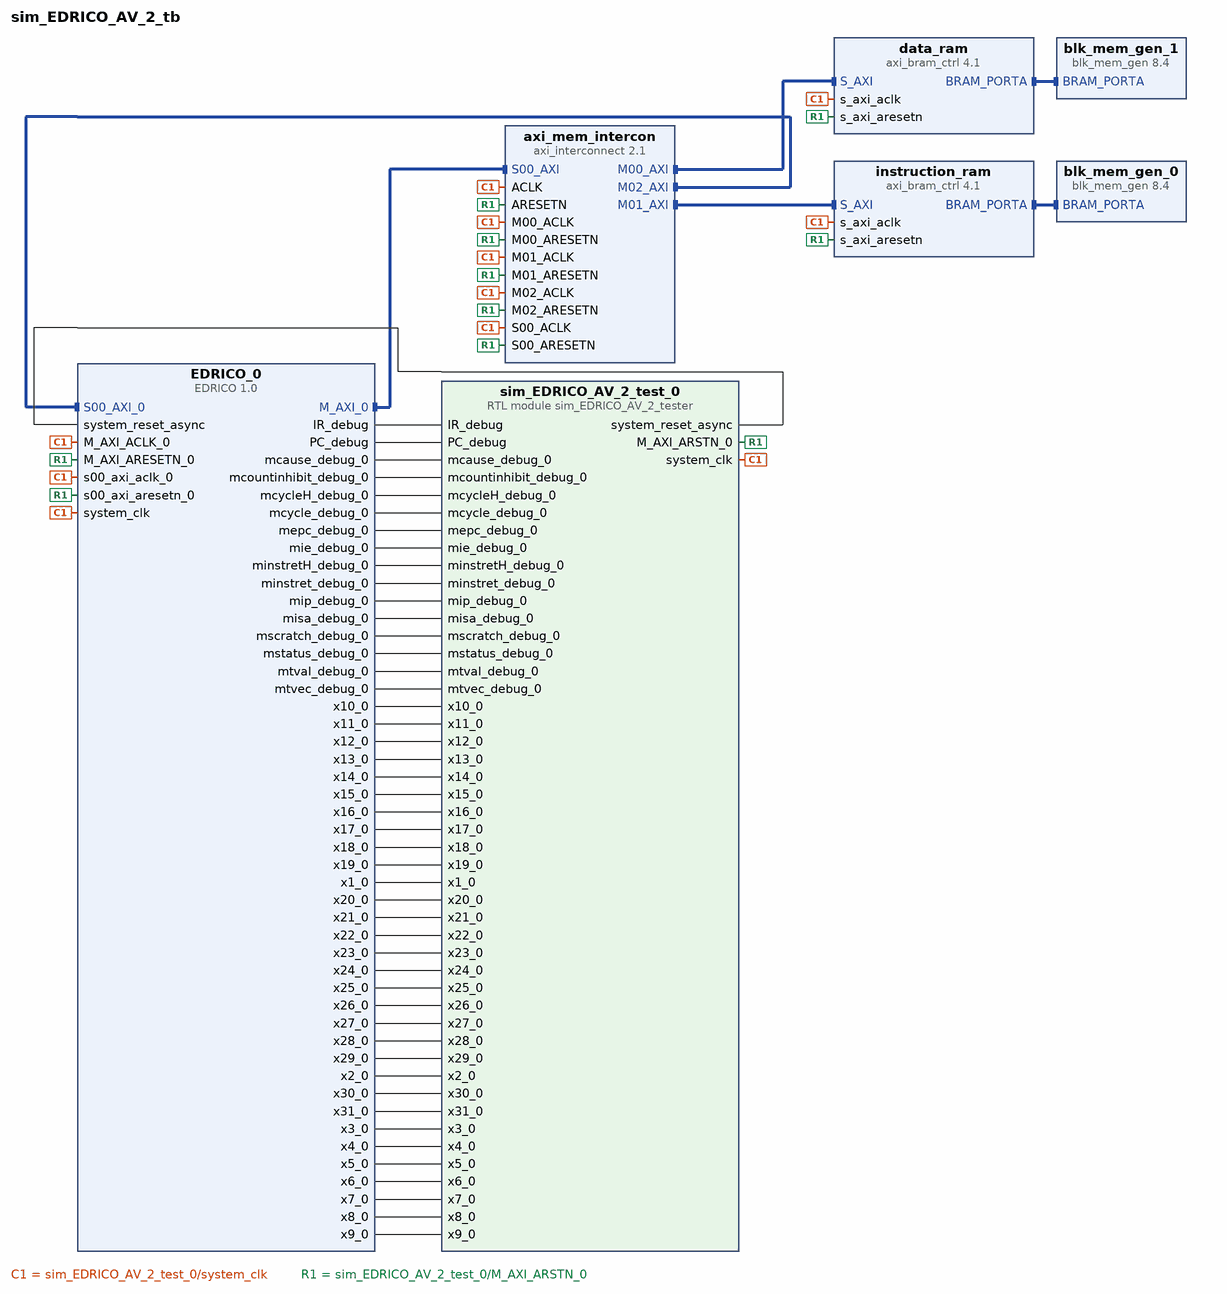
[diagram p0: block diagram of the top level]
# Vivado block design sim_EDRICO_AV_2_tb, xc7z020clg400-1, Vivado 2021.1
create_bd_design sim_EDRICO_AV_2_tb

create_bd_cell -type ip -vlnv xilinx.com:ip:axi_bram_ctrl:4.1 instruction_ram
set_property -dict {CONFIG.PROTOCOL AXI4LITE CONFIG.SINGLE_PORT_BRAM 1} [get_bd_cells instruction_ram]
create_bd_cell -type ip -vlnv xilinx.com:ip:axi_bram_ctrl:4.1 data_ram
set_property -dict {CONFIG.PROTOCOL AXI4LITE CONFIG.SINGLE_PORT_BRAM 1} [get_bd_cells data_ram]
create_bd_cell -type ip -vlnv xilinx.com:ip:blk_mem_gen:8.4 blk_mem_gen_0
set_property -dict [list \
  CONFIG.Coe_File ../../../../../sources_1/imports/EDRICO/simulation/sim_EDRICO_AV_2/sim_EDRICO_AV_2_tb_blk_mem_gen_0_1.coe \
  CONFIG.EN_SAFETY_CKT false \
  CONFIG.Load_Init_File true \
  CONFIG.Memory_Type Single_Port_ROM \
  CONFIG.Port_A_Write_Rate 0 \
] [get_bd_cells blk_mem_gen_0]
create_bd_cell -type ip -vlnv xilinx.com:ip:blk_mem_gen:8.4 blk_mem_gen_1
set_property -dict {CONFIG.EN_SAFETY_CKT false} [get_bd_cells blk_mem_gen_1]
create_bd_cell -type ip -vlnv xilinx.com:ip:axi_interconnect:2.1 axi_mem_intercon
set_property -dict {CONFIG.NUM_MI 3} [get_bd_cells axi_mem_intercon]
create_bd_cell -type module -reference sim_EDRICO_AV_2_tester sim_EDRICO_AV_2_test_0
create_bd_cell -type ip -vlnv DHBWRavensburg:EDRICO_lib:EDRICO:1.0 EDRICO_0

# ---- connections ----

connect_bd_intf_net [get_bd_intf_pins EDRICO_0/M_AXI_0] [get_bd_intf_pins axi_mem_intercon/S00_AXI]
connect_bd_intf_net [get_bd_intf_pins axi_mem_intercon/M00_AXI] [get_bd_intf_pins data_ram/S_AXI]
connect_bd_intf_net [get_bd_intf_pins axi_mem_intercon/M01_AXI] [get_bd_intf_pins instruction_ram/S_AXI]
connect_bd_intf_net [get_bd_intf_pins axi_mem_intercon/M02_AXI] [get_bd_intf_pins EDRICO_0/S00_AXI_0]
connect_bd_intf_net [get_bd_intf_pins blk_mem_gen_1/BRAM_PORTA] [get_bd_intf_pins data_ram/BRAM_PORTA]
connect_bd_intf_net [get_bd_intf_pins blk_mem_gen_0/BRAM_PORTA] [get_bd_intf_pins instruction_ram/BRAM_PORTA]
connect_bd_net [get_bd_pins EDRICO_0/IR_debug] [get_bd_pins sim_EDRICO_AV_2_test_0/IR_debug]
connect_bd_net [get_bd_pins EDRICO_0/PC_debug] [get_bd_pins sim_EDRICO_AV_2_test_0/PC_debug]
connect_bd_net [get_bd_pins EDRICO_0/mcause_debug_0] [get_bd_pins sim_EDRICO_AV_2_test_0/mcause_debug_0]
connect_bd_net [get_bd_pins EDRICO_0/mcountinhibit_debug_0] [get_bd_pins sim_EDRICO_AV_2_test_0/mcountinhibit_debug_0]
connect_bd_net [get_bd_pins EDRICO_0/mcycleH_debug_0] [get_bd_pins sim_EDRICO_AV_2_test_0/mcycleH_debug_0]
connect_bd_net [get_bd_pins EDRICO_0/mcycle_debug_0] [get_bd_pins sim_EDRICO_AV_2_test_0/mcycle_debug_0]
connect_bd_net [get_bd_pins EDRICO_0/mepc_debug_0] [get_bd_pins sim_EDRICO_AV_2_test_0/mepc_debug_0]
connect_bd_net [get_bd_pins EDRICO_0/mie_debug_0] [get_bd_pins sim_EDRICO_AV_2_test_0/mie_debug_0]
connect_bd_net [get_bd_pins EDRICO_0/minstretH_debug_0] [get_bd_pins sim_EDRICO_AV_2_test_0/minstretH_debug_0]
connect_bd_net [get_bd_pins EDRICO_0/minstret_debug_0] [get_bd_pins sim_EDRICO_AV_2_test_0/minstret_debug_0]
connect_bd_net [get_bd_pins EDRICO_0/mip_debug_0] [get_bd_pins sim_EDRICO_AV_2_test_0/mip_debug_0]
connect_bd_net [get_bd_pins EDRICO_0/misa_debug_0] [get_bd_pins sim_EDRICO_AV_2_test_0/misa_debug_0]
connect_bd_net [get_bd_pins EDRICO_0/mscratch_debug_0] [get_bd_pins sim_EDRICO_AV_2_test_0/mscratch_debug_0]
connect_bd_net [get_bd_pins EDRICO_0/mstatus_debug_0] [get_bd_pins sim_EDRICO_AV_2_test_0/mstatus_debug_0]
connect_bd_net [get_bd_pins EDRICO_0/mtval_debug_0] [get_bd_pins sim_EDRICO_AV_2_test_0/mtval_debug_0]
connect_bd_net [get_bd_pins EDRICO_0/mtvec_debug_0] [get_bd_pins sim_EDRICO_AV_2_test_0/mtvec_debug_0]
connect_bd_net [get_bd_pins EDRICO_0/x10_0] [get_bd_pins sim_EDRICO_AV_2_test_0/x10_0]
connect_bd_net [get_bd_pins EDRICO_0/x11_0] [get_bd_pins sim_EDRICO_AV_2_test_0/x11_0]
connect_bd_net [get_bd_pins EDRICO_0/x12_0] [get_bd_pins sim_EDRICO_AV_2_test_0/x12_0]
connect_bd_net [get_bd_pins EDRICO_0/x13_0] [get_bd_pins sim_EDRICO_AV_2_test_0/x13_0]
connect_bd_net [get_bd_pins EDRICO_0/x14_0] [get_bd_pins sim_EDRICO_AV_2_test_0/x14_0]
connect_bd_net [get_bd_pins EDRICO_0/x15_0] [get_bd_pins sim_EDRICO_AV_2_test_0/x15_0]
connect_bd_net [get_bd_pins EDRICO_0/x16_0] [get_bd_pins sim_EDRICO_AV_2_test_0/x16_0]
connect_bd_net [get_bd_pins EDRICO_0/x17_0] [get_bd_pins sim_EDRICO_AV_2_test_0/x17_0]
connect_bd_net [get_bd_pins EDRICO_0/x18_0] [get_bd_pins sim_EDRICO_AV_2_test_0/x18_0]
connect_bd_net [get_bd_pins EDRICO_0/x19_0] [get_bd_pins sim_EDRICO_AV_2_test_0/x19_0]
connect_bd_net [get_bd_pins EDRICO_0/x1_0] [get_bd_pins sim_EDRICO_AV_2_test_0/x1_0]
connect_bd_net [get_bd_pins EDRICO_0/x20_0] [get_bd_pins sim_EDRICO_AV_2_test_0/x20_0]
connect_bd_net [get_bd_pins EDRICO_0/x21_0] [get_bd_pins sim_EDRICO_AV_2_test_0/x21_0]
connect_bd_net [get_bd_pins EDRICO_0/x22_0] [get_bd_pins sim_EDRICO_AV_2_test_0/x22_0]
connect_bd_net [get_bd_pins EDRICO_0/x23_0] [get_bd_pins sim_EDRICO_AV_2_test_0/x23_0]
connect_bd_net [get_bd_pins EDRICO_0/x24_0] [get_bd_pins sim_EDRICO_AV_2_test_0/x24_0]
connect_bd_net [get_bd_pins EDRICO_0/x25_0] [get_bd_pins sim_EDRICO_AV_2_test_0/x25_0]
connect_bd_net [get_bd_pins EDRICO_0/x26_0] [get_bd_pins sim_EDRICO_AV_2_test_0/x26_0]
connect_bd_net [get_bd_pins EDRICO_0/x27_0] [get_bd_pins sim_EDRICO_AV_2_test_0/x27_0]
connect_bd_net [get_bd_pins EDRICO_0/x28_0] [get_bd_pins sim_EDRICO_AV_2_test_0/x28_0]
connect_bd_net [get_bd_pins EDRICO_0/x29_0] [get_bd_pins sim_EDRICO_AV_2_test_0/x29_0]
connect_bd_net [get_bd_pins EDRICO_0/x2_0] [get_bd_pins sim_EDRICO_AV_2_test_0/x2_0]
connect_bd_net [get_bd_pins EDRICO_0/x30_0] [get_bd_pins sim_EDRICO_AV_2_test_0/x30_0]
connect_bd_net [get_bd_pins EDRICO_0/x31_0] [get_bd_pins sim_EDRICO_AV_2_test_0/x31_0]
connect_bd_net [get_bd_pins EDRICO_0/x3_0] [get_bd_pins sim_EDRICO_AV_2_test_0/x3_0]
connect_bd_net [get_bd_pins EDRICO_0/x4_0] [get_bd_pins sim_EDRICO_AV_2_test_0/x4_0]
connect_bd_net [get_bd_pins EDRICO_0/x5_0] [get_bd_pins sim_EDRICO_AV_2_test_0/x5_0]
connect_bd_net [get_bd_pins EDRICO_0/x6_0] [get_bd_pins sim_EDRICO_AV_2_test_0/x6_0]
connect_bd_net [get_bd_pins EDRICO_0/x7_0] [get_bd_pins sim_EDRICO_AV_2_test_0/x7_0]
connect_bd_net [get_bd_pins EDRICO_0/x8_0] [get_bd_pins sim_EDRICO_AV_2_test_0/x8_0]
connect_bd_net [get_bd_pins EDRICO_0/x9_0] [get_bd_pins sim_EDRICO_AV_2_test_0/x9_0]
connect_bd_net -net clk_wiz_clk_out1 [get_bd_pins sim_EDRICO_AV_2_test_0/system_clk] \
  [get_bd_pins axi_mem_intercon/S00_ACLK] [get_bd_pins data_ram/s_axi_aclk] [get_bd_pins axi_mem_intercon/M00_ACLK] \
  [get_bd_pins axi_mem_intercon/ACLK] [get_bd_pins instruction_ram/s_axi_aclk] [get_bd_pins axi_mem_intercon/M01_ACLK] \
  [get_bd_pins axi_mem_intercon/M02_ACLK] [get_bd_pins EDRICO_0/M_AXI_ACLK_0] [get_bd_pins EDRICO_0/system_clk] \
  [get_bd_pins EDRICO_0/s00_axi_aclk_0]
connect_bd_net -net rst_clk_wiz_100M_peripheral_aresetn [get_bd_pins sim_EDRICO_AV_2_test_0/M_AXI_ARSTN_0] \
  [get_bd_pins axi_mem_intercon/S00_ARESETN] [get_bd_pins data_ram/s_axi_aresetn] [get_bd_pins axi_mem_intercon/M00_ARESETN] \
  [get_bd_pins axi_mem_intercon/ARESETN] [get_bd_pins instruction_ram/s_axi_aresetn] \
  [get_bd_pins axi_mem_intercon/M01_ARESETN] [get_bd_pins axi_mem_intercon/M02_ARESETN] \
  [get_bd_pins EDRICO_0/M_AXI_ARESETN_0] [get_bd_pins EDRICO_0/s00_axi_aresetn_0]
connect_bd_net [get_bd_pins sim_EDRICO_AV_2_test_0/system_reset_async] [get_bd_pins EDRICO_0/system_reset_async]

# ---- address map ----
assign_bd_address -offset 0x00000000 -range 8K -target_address_space [get_bd_addr_spaces EDRICO_0/M_AXI_0] [get_bd_addr_segs instruction_ram/S_AXI/Mem0]
assign_bd_address -offset 0x02000000 -range 32K -target_address_space [get_bd_addr_spaces EDRICO_0/M_AXI_0] [get_bd_addr_segs EDRICO_0/S00_AXI_0/Reg0]
assign_bd_address -offset 0xA0000000 -range 8K -target_address_space [get_bd_addr_spaces EDRICO_0/M_AXI_0] [get_bd_addr_segs data_ram/S_AXI/Mem0]

validate_bd_design
save_bd_design
